# Altium schematic sheet Compute_module4_connector.SchDoc
size A2; SheetNumber: 1; SheetTotal: 5
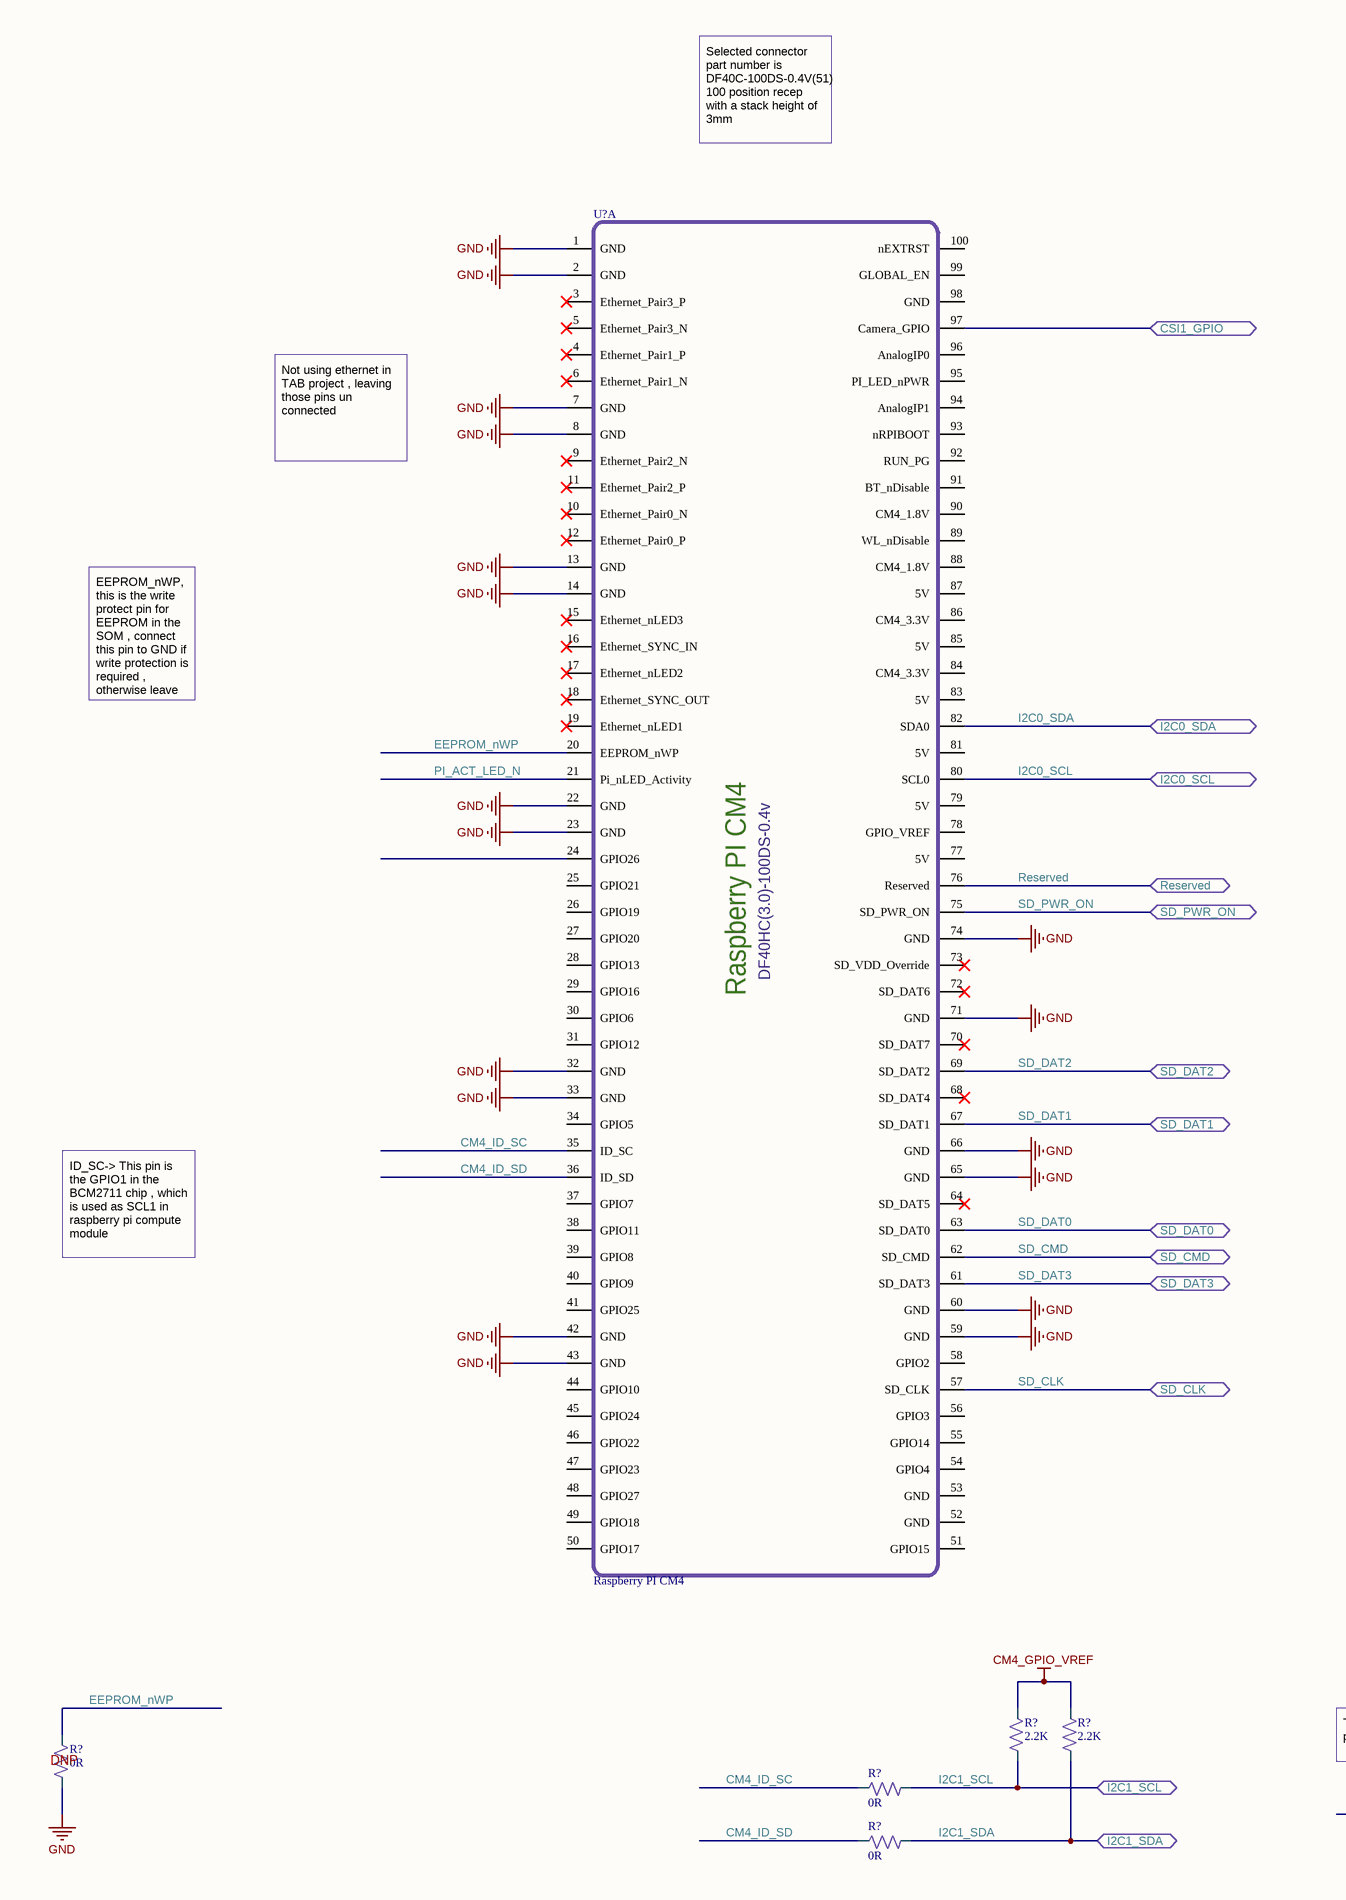
[diagram p0: Compute_module4_connector.SchDoc, left]
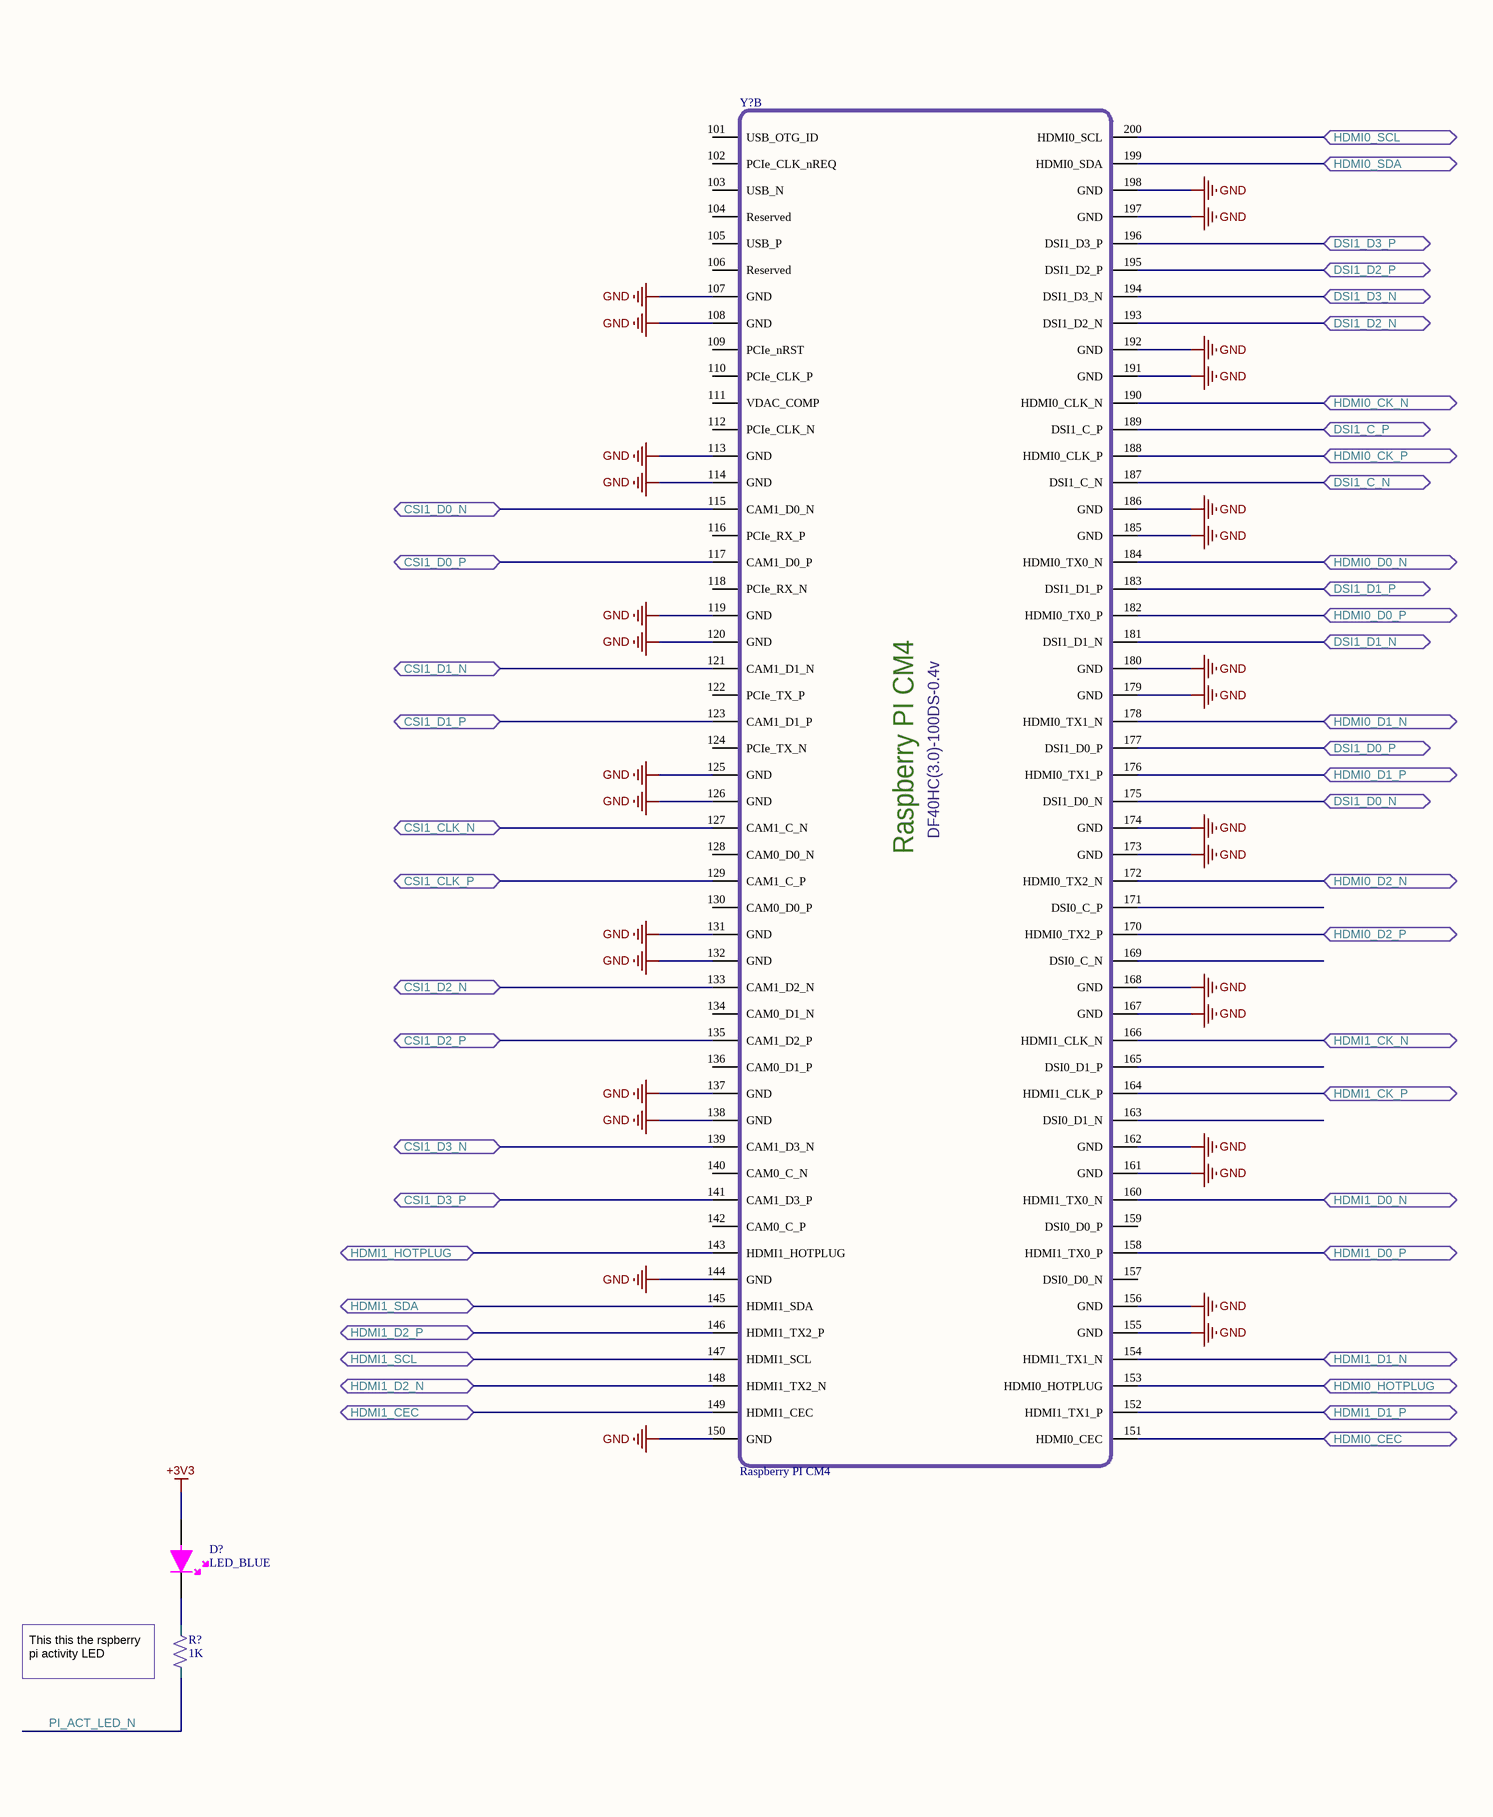
[diagram p1: Compute_module4_connector.SchDoc, right]

## Parts
(Parts that share a designator on the sheet are numbered #1, #2 ... from top to bottom, then left to right.)
D?  LED_BLUE  [0603_LED]
R?#1  2.2K  [RESISTOR_0402]
R?#2  2.2K  [RESISTOR_0402]
R?#3  1K  [RESISTOR_0402]
R?#4  0R  [RESISTOR_0402]
R?#5  0R  [RESISTOR_0402]
R?#6  0R  [RESISTOR_0402]
U?  Raspberry PI CM4  [CM4-DF40HC(3.0)-100DS-0.4v_3mm_1.5mm]  (part A of 2)
Y?  Raspberry PI CM4  [CM4-DF40HC(3.0)-100DS-0.4v_3mm_1.5mm]  (part B of 2)

## Ports
CSI1_CLK_N (bidir), CSI1_CLK_P (bidir), CSI1_D0_N (bidir), CSI1_D0_P (bidir), CSI1_D1_N (bidir), CSI1_D1_P (bidir), CSI1_D2_N (bidir), CSI1_D2_P (bidir), CSI1_D3_N (bidir), CSI1_D3_P (bidir), CSI1_GPIO (bidir), DSI1_C_N (bidir), DSI1_C_P (bidir), DSI1_D0_N (bidir), DSI1_D0_P (bidir), DSI1_D1_N (bidir), DSI1_D1_P (bidir), DSI1_D2_N (bidir), DSI1_D2_P (bidir), DSI1_D3_N (bidir), DSI1_D3_P (bidir), HDMI0_CEC (bidir), HDMI0_CK_N (bidir), HDMI0_CK_P (bidir), HDMI0_D0_N (bidir), HDMI0_D0_P (bidir), HDMI0_D1_N (bidir), HDMI0_D1_P (bidir), HDMI0_D2_N (bidir), HDMI0_D2_P (bidir), HDMI0_HOTPLUG (bidir), HDMI0_SCL (bidir), HDMI0_SDA (bidir), HDMI1_CEC (bidir), HDMI1_CK_N (bidir), HDMI1_CK_P (bidir), HDMI1_D0_N (bidir), HDMI1_D0_P (bidir), HDMI1_D1_N (bidir), HDMI1_D1_P (bidir), HDMI1_D2_N (bidir), HDMI1_D2_P (bidir), HDMI1_HOTPLUG (bidir), HDMI1_SCL (bidir), HDMI1_SDA (bidir), I2C0_SCL (bidir), I2C0_SDA (bidir), I2C1_SCL (bidir), I2C1_SDA (bidir), Reserved (bidir), SD_CLK (bidir), SD_CMD (bidir), SD_DAT0 (bidir), SD_DAT1 (bidir), SD_DAT2 (bidir), SD_DAT3 (bidir), SD_PWR_ON (bidir)

## Nets
+3V3: D?.1
CM4_GPIO_VREF: R?#1.2 R?#2.2
GND: R?#4.1 U?.1(GND) U?.2(GND) U?.7(GND) U?.8(GND) U?.13(GND) U?.14(GND) U?.22(GND) U?.23(GND) U?.32(GND) U?.33(GND) U?.42(GND) U?.43(GND) U?.59(GND) U?.60(GND) U?.65(GND) U?.66(GND) U?.71(GND) U?.74(GND) Y?.107(GND) Y?.108(GND) Y?.113(GND) Y?.114(GND) Y?.119(GND) Y?.120(GND) Y?.125(GND) Y?.126(GND) Y?.131(GND) Y?.132(GND) Y?.137(GND) Y?.138(GND) Y?.144(GND) Y?.150(GND) Y?.155(GND) Y?.156(GND) Y?.161(GND) Y?.162(GND) Y?.167(GND) Y?.168(GND) Y?.173(GND) Y?.174(GND) Y?.179(GND) Y?.180(GND) Y?.185(GND) Y?.186(GND) Y?.191(GND) Y?.192(GND) Y?.197(GND) Y?.198(GND)
CM4_ID_SC: R?#5.2 U?.35(ID_SC)
CM4_ID_SD: R?#6.2 U?.36(ID_SD)
CSI1_CLK_N: Y?.127(CAM1_C_N) ; port CSI1_CLK_N
CSI1_CLK_P: Y?.129(CAM1_C_P) ; port CSI1_CLK_P
CSI1_D0_N: Y?.115(CAM1_D0_N) ; port CSI1_D0_N
CSI1_D0_P: Y?.117(CAM1_D0_P) ; port CSI1_D0_P
CSI1_D1_N: Y?.121(CAM1_D1_N) ; port CSI1_D1_N
CSI1_D1_P: Y?.123(CAM1_D1_P) ; port CSI1_D1_P
CSI1_D2_N: Y?.133(CAM1_D2_N) ; port CSI1_D2_N
CSI1_D2_P: Y?.135(CAM1_D2_P) ; port CSI1_D2_P
CSI1_D3_N: Y?.139(CAM1_D3_N) ; port CSI1_D3_N
CSI1_D3_P: Y?.141(CAM1_D3_P) ; port CSI1_D3_P
CSI1_GPIO: U?.97(Camera_GPIO) ; port CSI1_GPIO
DSI1_C_N: Y?.187(DSI1_C_N) ; port DSI1_C_N
DSI1_C_P: Y?.189(DSI1_C_P) ; port DSI1_C_P
DSI1_D0_N: Y?.175(DSI1_D0_N) ; port DSI1_D0_N
DSI1_D0_P: Y?.177(DSI1_D0_P) ; port DSI1_D0_P
DSI1_D1_N: Y?.181(DSI1_D1_N) ; port DSI1_D1_N
DSI1_D1_P: Y?.183(DSI1_D1_P) ; port DSI1_D1_P
DSI1_D2_N: Y?.193(DSI1_D2_N) ; port DSI1_D2_N
DSI1_D2_P: Y?.195(DSI1_D2_P) ; port DSI1_D2_P
DSI1_D3_N: Y?.194(DSI1_D3_N) ; port DSI1_D3_N
DSI1_D3_P: Y?.196(DSI1_D3_P) ; port DSI1_D3_P
EEPROM_nWP: R?#4.2 U?.20(EEPROM_nWP)
HDMI0_CEC: Y?.151(HDMI0_CEC) ; port HDMI0_CEC
HDMI0_CK_N: Y?.190(HDMI0_CLK_N) ; port HDMI0_CK_N
HDMI0_CK_P: Y?.188(HDMI0_CLK_P) ; port HDMI0_CK_P
HDMI0_D0_N: Y?.184(HDMI0_TX0_N) ; port HDMI0_D0_N
HDMI0_D0_P: Y?.182(HDMI0_TX0_P) ; port HDMI0_D0_P
HDMI0_D1_N: Y?.178(HDMI0_TX1_N) ; port HDMI0_D1_N
HDMI0_D1_P: Y?.176(HDMI0_TX1_P) ; port HDMI0_D1_P
HDMI0_D2_N: Y?.172(HDMI0_TX2_N) ; port HDMI0_D2_N
HDMI0_D2_P: Y?.170(HDMI0_TX2_P) ; port HDMI0_D2_P
HDMI0_HOTPLUG: Y?.153(HDMI0_HOTPLUG) ; port HDMI0_HOTPLUG
HDMI0_SCL: Y?.200(HDMI0_SCL) ; port HDMI0_SCL
HDMI0_SDA: Y?.199(HDMI0_SDA) ; port HDMI0_SDA
HDMI1_CEC: Y?.149(HDMI1_CEC) ; port HDMI1_CEC
HDMI1_CK_N: Y?.166(HDMI1_CLK_N) ; port HDMI1_CK_N
HDMI1_CK_P: Y?.164(HDMI1_CLK_P) ; port HDMI1_CK_P
HDMI1_D0_N: Y?.160(HDMI1_TX0_N) ; port HDMI1_D0_N
HDMI1_D0_P: Y?.158(HDMI1_TX0_P) ; port HDMI1_D0_P
HDMI1_D1_N: Y?.154(HDMI1_TX1_N) ; port HDMI1_D1_N
HDMI1_D1_P: Y?.152(HDMI1_TX1_P) ; port HDMI1_D1_P
HDMI1_D2_N: Y?.148(HDMI1_TX2_N) ; port HDMI1_D2_N
HDMI1_D2_P: Y?.146(HDMI1_TX2_P) ; port HDMI1_D2_P
HDMI1_HOTPLUG: Y?.143(HDMI1_HOTPLUG) ; port HDMI1_HOTPLUG
HDMI1_SCL: Y?.147(HDMI1_SCL) ; port HDMI1_SCL
HDMI1_SDA: Y?.145(HDMI1_SDA) ; port HDMI1_SDA
I2C0_SCL: U?.80(SCL0) ; port I2C0_SCL
I2C0_SDA: U?.82(SDA0) ; port I2C0_SDA
I2C1_SCL: R?#1.1 R?#5.1 ; port I2C1_SCL
I2C1_SDA: R?#2.1 R?#6.1 ; port I2C1_SDA
PI_ACT_LED_N: R?#3.1 U?.21(Pi_nLED_Activity)
Reserved: U?.76(Reserved) ; port Reserved
SD_CLK: U?.57(SD_CLK) ; port SD_CLK
SD_CMD: U?.62(SD_CMD) ; port SD_CMD
SD_DAT0: U?.63(SD_DAT0) ; port SD_DAT0
SD_DAT1: U?.67(SD_DAT1) ; port SD_DAT1
SD_DAT2: U?.69(SD_DAT2) ; port SD_DAT2
SD_DAT3: U?.61(SD_DAT3) ; port SD_DAT3
SD_PWR_ON: U?.75(SD_PWR_ON) ; port SD_PWR_ON
NetD?_2: D?.2 R?#3.2

Not connected (* = marked no-connect by the designer): U? 3(Ethernet_Pair3_P)* 4(Ethernet_Pair1_P)* 5(Ethernet_Pair3_N)* 6(Ethernet_Pair1_N)* 9(Ethernet_Pair2_N)* 10(Ethernet_Pair0_N)* 11(Ethernet_Pair2_P)* 12(Ethernet_Pair0_P)* 15(Ethernet_nLED3)* 16(Ethernet_SYNC_IN)* 17(Ethernet_nLED2)* 18(Ethernet_SYNC_OUT)* 19(Ethernet_nLED1)* 24(GPIO26) 25(GPIO21) 26(GPIO19) 27(GPIO20) 28(GPIO13) 29(GPIO16) 30(GPIO6) 31(GPIO12) 34(GPIO5) 37(GPIO7) 38(GPIO11) 39(GPIO8) 40(GPIO9) 41(GPIO25) 44(GPIO10) 45(GPIO24) 46(GPIO22) 47(GPIO23) 48(GPIO27) 49(GPIO18) 50(GPIO17) 51(GPIO15) 52(GND) 53(GND) 54(GPIO4) 55(GPIO14) 56(GPIO3) 58(GPIO2) 64(SD_DAT5)* 68(SD_DAT4)* 70(SD_DAT7)* 72(SD_DAT6)* 73(SD_VDD_Override)* 77(5V) 78(GPIO_VREF) 79(5V) 81(5V) 83(5V) 84(CM4_3.3V) 85(5V) 86(CM4_3.3V) 87(5V) 88(CM4_1.8V) 89(WL_nDisable) 90(CM4_1.8V) 91(BT_nDisable) 92(RUN_PG) 93(nRPIBOOT) 94(AnalogIP1) 95(PI_LED_nPWR) 96(AnalogIP0) 98(GND) 99(GLOBAL_EN) 100(nEXTRST); Y? 101(USB_OTG_ID) 102(PCIe_CLK_nREQ) 103(USB_N) 104(Reserved) 105(USB_P) 106(Reserved) 109(PCIe_nRST) 110(PCIe_CLK_P) 111(VDAC_COMP) 112(PCIe_CLK_N) 116(PCIe_RX_P) 118(PCIe_RX_N) 122(PCIe_TX_P) 124(PCIe_TX_N) 128(CAM0_D0_N) 130(CAM0_D0_P) 134(CAM0_D1_N) 136(CAM0_D1_P) 140(CAM0_C_N) 142(CAM0_C_P) 157(DSI0_D0_N) 159(DSI0_D0_P) 163(DSI0_D1_N) 165(DSI0_D1_P) 169(DSI0_C_N) 171(DSI0_C_P)

## Notes on the sheet
- Selected connector part number is DF40C-100DS-0.4V(51)
  100 position recep with a stack height of 3mm
- Not using ethernet in TAB project , leaving those pins un connected
- EEPROM_nWP, this is the write protect pin for EEPROM in the SOM , connect this pin to GND if write protection is required , otherwise leave this pin unconnected , an  internal pull up is provided for this via 100K resistor to 3v3
- ID_SC-> This pin is the GPIO1 in the BCM2711 chip , which is used as SCL1 in raspberry pi compute module
  ID_SC -> This pin is the GPIO0 pin in the BCM2711 chip , which is used as SDA1 in raspberry pi compute module
- (near R?#4) DNP
- (near R?#3) This this the rspberry pi activity LED
- (in symbol cm4, part A) DF40HC(3.0)-100DS-0.4v
- (in symbol cm4, part B) DF40HC(3.0)-100DS-0.4v

## Library data of the parts
D? = NCD0603B1: blue 0603 Light Emitting Diodes (LED) ROHS; Manufacturer: Foshan; ManufacturerPartNumber: NCD0603B1; SupplierPartNumber: C84266; Supplier: LCSC; MinTemp: *; MaxTemp: *; Price: 0.0171; ComponentLink1Description: SupplierURL; ComponentLink1URL: https://www.lcsc.com/product-detail/Light-Emitting-Diodes-LED_Foshan-NationStar-Optoelectronics-NCD0603B1_C84266.html
R?#1 R?#2 = ERJPA2F2201X: 200mW Thick Film Resistors ±1% 2.2kΩ 0402 Chip Resistor - Surface Mount ROHS; Manufacturer: Panasonic; MinTemp: -55℃; MaxTemp: +155℃; ManufacturerPartNumber: ERJPA2F2201X; SupplierPartNumber: C427242; Supplier: LCSC; Price: 0.0307; ComponentLink1Description: SupplierURL; ComponentLink1URL: https://www.lcsc.com/product-detail/Chip-Resistor-Surface-Mount_PANASONIC-ERJPA2F2201X_C427242.html
R?#3 = ERJ2RKF1001X: ±1% 100mW ±100ppm/℃ -55℃~+155℃ 1kΩ 0402 Chip Resistor - Surface Mount ROHS; Manufacturer: PANASONIC; MinTemp: -55℃; MaxTemp: +155℃; ManufacturerPartNumber: ERJ2RKF1001X; SupplierPartNumber: C242161; Supplier: LCSC; ComponentLink1Description: SupplierURL; ComponentLink1URL: https://lcsc.com/product-detail/Chip-Resistor-Surface-Mount_PANASONIC-ERJ2RKF1001X_C242161.html
R?#4 = HCJ0402ZT0R00_1: 125mW Thick Film Resistors -55℃~+155℃ 0Ω 0402 Chip Resistor - Surface Mount ROHS; Manufacturer: SEI(Stackpole Elec); MinTemp: -55℃; MaxTemp: +155℃; ManufacturerPartNumber: HCJ0402ZT0R00; SupplierPartNumber: C346504; Supplier: LCSC; Price: 0.1734; ComponentLink1Description: SupplierURL; ComponentLink1URL: https://lcsc.com/product-detail/Chip-Resistor-Surface-Mount_SEI-Stackpole-Elec-HCJ0402ZT0R00_C346504.html
R?#5 R?#6 = HCJ0402ZT0R00: 0 Ohms Jumper 0.125W, 1/8W Chip Resistor 0402 (1005 Metric) Automotive AEC-Q200 Metal Foil; Manufacturer: Stackpole Electronics Inc; MinTemp: -55°C; MaxTemp: 155°C; ManufacturerPartNumber: HCJ0402ZT0R00; SupplierPartNumber: HCJ0402ZT0R00CT-ND; Supplier: Digikey; PartStatus: Active; Price: 38.65(INR); ComponentLink1Description: SupplierURL; ComponentLink1URL: https://www.digikey.in/en/products/detail/stackpole-electronics-inc/HCJ0402ZT0R00/4357659
U? Y? = cm4: Raspberry pi compute module 4